# Altium schematic sheet Push_Button.SchDoc
size A4
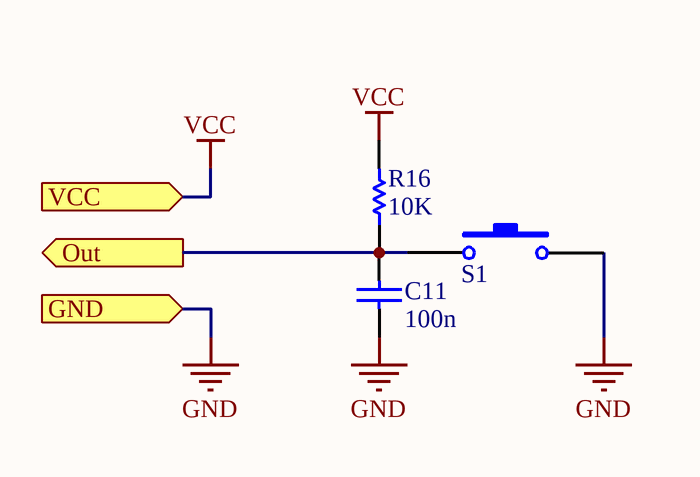
[diagram p0: Push_Button.SchDoc]

## Parts
C11  value 100n  [CS-0603]  (hidden comment: CS - CAPACITOR)
R16  value 10K  [RS-0603]  (hidden comment: RS - RESISTOR)
S1  SW - Tactile Switch  [SW-FSMSM]  (value not drawn)

## Ports
GND (in), Out (out), VCC (in)

## Nets
GND: C11.1 S1.2 ; port GND
VCC: R16.2 ; port VCC
Out: C11.2 R16.1 S1.1 ; port Out

## Library data of the parts
C11 = CS - CAPACITOR: TOLERANCE: 10%; VOLTAGE: 16V; Supplier 1: *; Supplier Part Number 1: 490-1532-1-ND; (FIELD A): *; (FLIED C): *; (FIELD B): *; Manufacturer: *
R16 = RS - RESISTOR: TOLERANCE: RES TOL; POWER: RES POWER; Supplier Part Number 1: *; Supplier 1: *; (FIELD A): *; (FLIED C): *; (FIELD B): *; Manufacturer: *
S1 = SW - Tactile Switch: Supplier 1: Digi-Key; Supplier Part Number 1: 450-1658-ND; (FLIED A): *; (FLIED B): *; (FLIED C): *; Manufacturer: *; Supplier 2: Digi-Key; Supplier Part Number 2: 450-1758-2-ND